# EAGLE schematic Szineszfeny_mego (EAGLE 6.1)
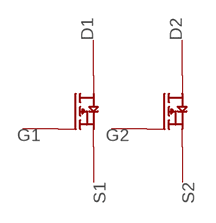
[diagram p0: schematic, sheet 1]

## Parts
D1  PADSMD_KICSI  [PAD_SMD_KICSI]
D2  PADSMD_KICSI  [PAD_SMD_KICSI]
G1  PADSMD_KICSI  [PAD_SMD_KICSI]
G2  PADSMD_KICSI  [PAD_SMD_KICSI]
S1  PADSMD_KICSI  [PAD_SMD_KICSI]
S2  PADSMD_KICSI  [PAD_SMD_KICSI]
U$1  AP2625GY-HF-3SOT26  [SOT26]

## Nets
N$1: G1.P$4 U$1.P$1(G)
N$2: S1.P$4 U$1.P$5(S)
N$3: D1.P$4 U$1.P$6(D)
N$4: G2.P$4 U$1.P$3(G)
N$5: S2.P$4 U$1.P$2(S)
N$6: D2.P$4 U$1.P$4(D)

## Library data of the parts
D1 D2 G1 G2 S1 S2 = narval:PAD
U$1 = narval:AP2625GY-HF-3